# EAGLE design CNC-PowerSwitch-2016-v0.92 (EAGLE 7.7.0)

## Sheet 1 of 3
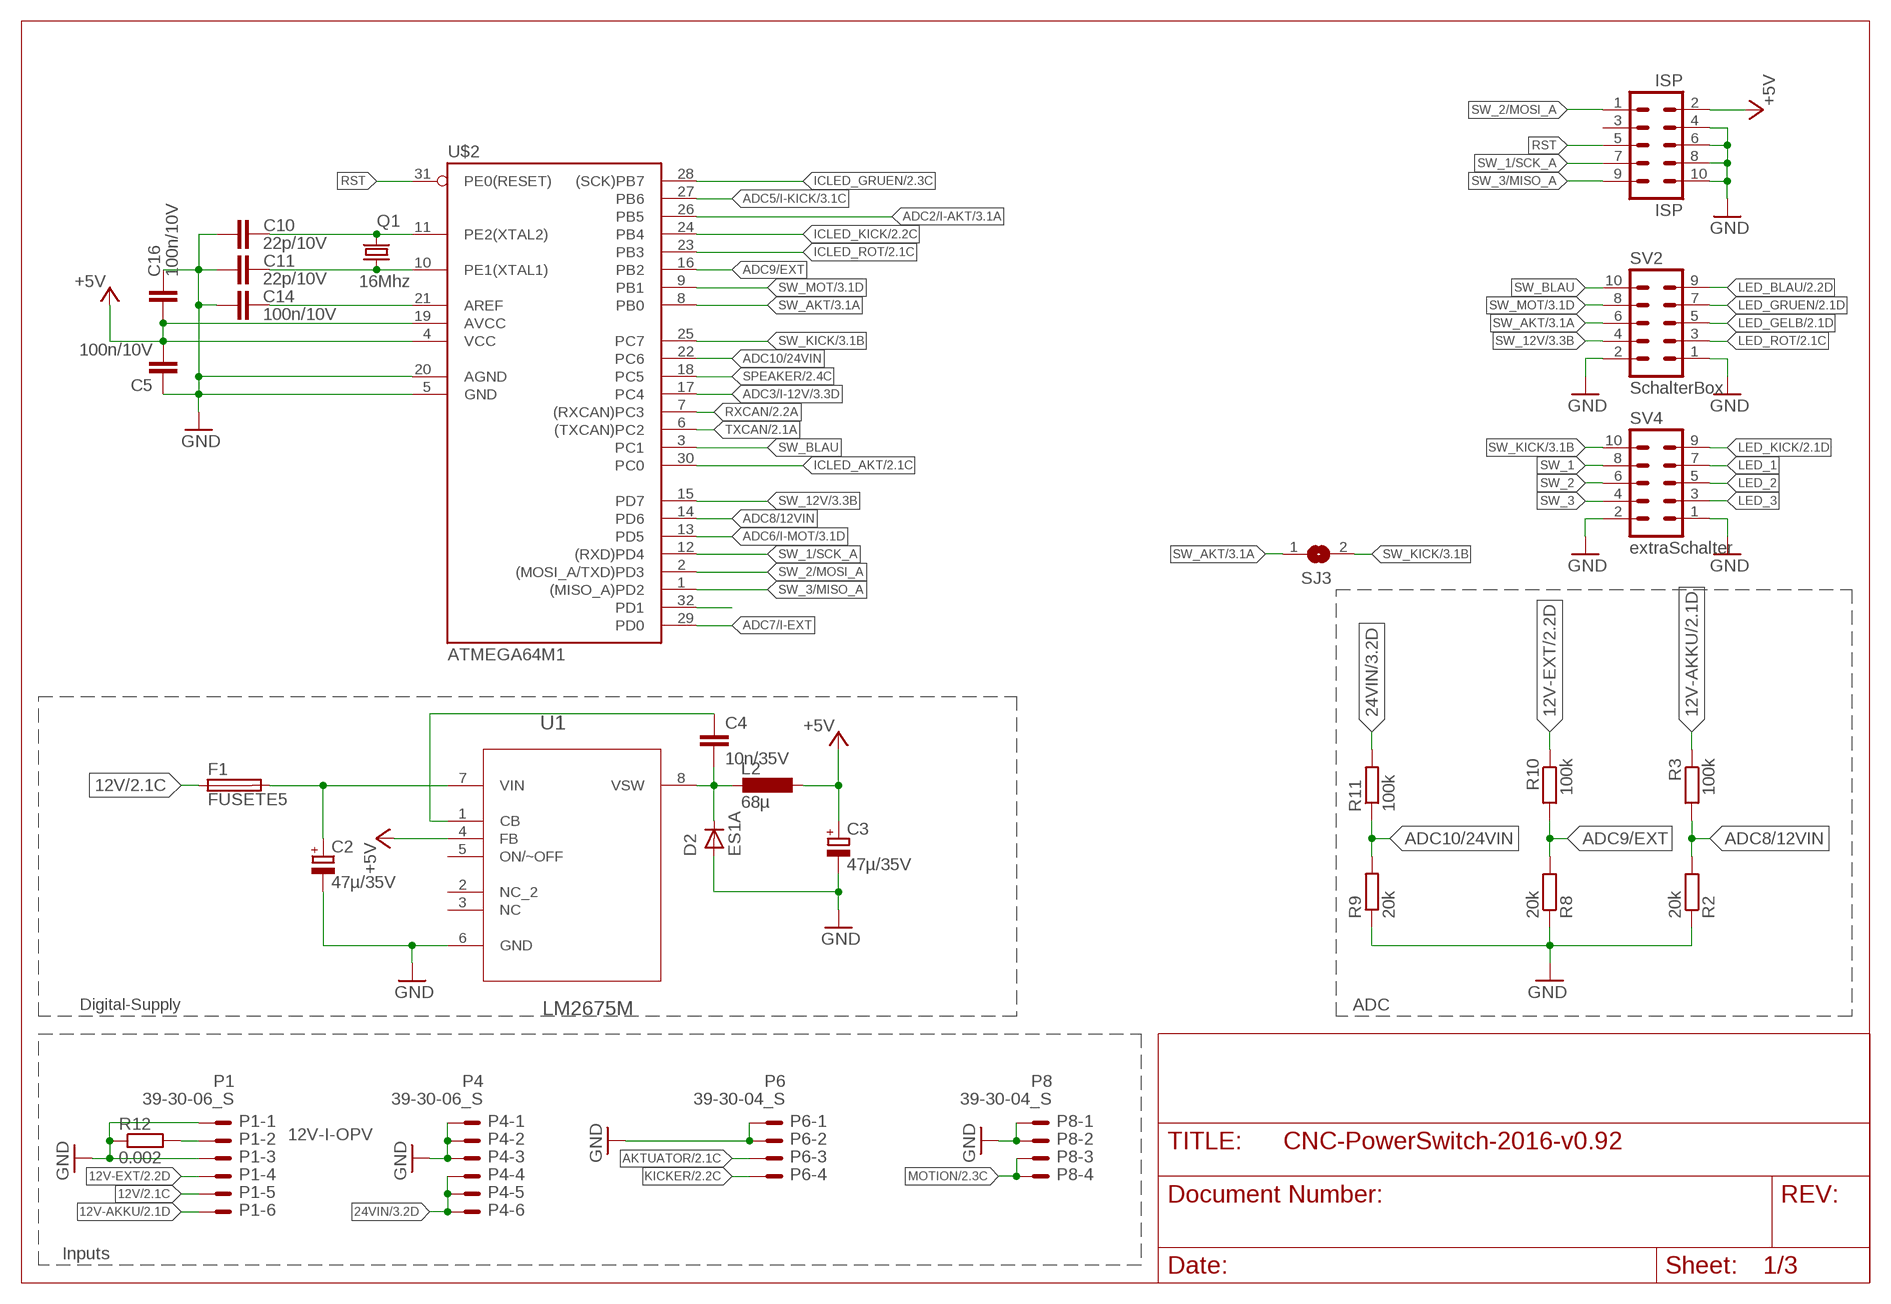
[diagram p0: schematic, sheet 1]

### Parts
C2  47µ/35V  CPOL-EUD  [PANASONIC_D]
C3  47µ/35V  CPOL-EUD  [PANASONIC_D]
C4  10n/35V  C-EUC0603  [C0603]
C5  100n/10V  C-EUC0603  [C0603]
C10  22p/10V  C-EUC0603  [C0603]
C11  22p/10V  C-EUC0603  [C0603]
C14  100n/10V  C-EUC0603  [C0603]
C16  100n/10V  C-EUC0603  [C0603]
D2  ES1A  GF1  [SMA-DO214AC]
F1  FUSETE5  [TE5]
ISP  ISP  ML10  [ML10]
L2  68µ  L-EUPISM  [PISM]
P1  39-30-06_S  [39-30-?06?]
P4  39-30-06_S  [39-30-?06?]
P6  39-30-04_S  [39-30-?04?]
P8  39-30-04_S  [39-30-?04?]
Q1  16Mhz  CRYSTALHC49UP  [HC49UP]
R2  20k  R-EU_R0805  [R0805]
R3  100k  R-EU_R0805  [R0805]
R8  20k  R-EU_R0805  [R0805]
R9  20k  R-EU_R0805  [R0805]
R10  100k  R-EU_R0805  [R0805]
R11  100k  R-EU_R0805  [R0805]
R12  0.002  R-EU_R2512  [R2512]
SJ3  SJ  [SJ]
SV2  SchalterBox  ML10  [ML10]
SV4  extraSchalter  ML10  [ML10]
U1  LM2675M  LM2675M-3.3  [SOIC127P620X175-8N]
U$2  ATMEGA64M1  [TQFP32-08]

### Nets
12V: F1.1 P1.5 ; also sheet 2,3
12V-AKKU: P1.6 R3.1 ; also sheet 2,3
12V-EXT: P1.4 R10.1 ; also sheet 2,3
12V-I-OPV: P1.2 R12.2 ; also sheet 3
24VIN: P4.4 P4.5 P4.6 R11.2 ; also sheet 3
+5V: C3.+ C5.2 C16.1 ISP.2 L2.1 U1.4(FB) U$2.4(VCC) U$2.19(AVCC) ; also sheet 2,3
ADC2/I-AKT: U$2.26(PB5) ; also sheet 3
ADC3/I-12V: U$2.17(PC4) ; also sheet 3
ADC5/I-KICK: U$2.27(PB6) ; also sheet 3
ADC6/I-MOT: U$2.13(PD5) ; also sheet 3
ADC7/I-EXT: U$2.29(PD0)
ADC8/12VIN: R2.2 R3.2 U$2.14(PD6)
ADC9/EXT: R8.2 R10.2 U$2.16(PB2)
ADC10/24VIN: R9.2 R11.1 U$2.22(PC6)
AKTUATOR: P6.3 ; also sheet 2,3
GND: C2.- C3.- C5.1 C10.1 C11.1 C14.1 C16.2 D2.A ISP.4 ISP.6 ISP.8 ISP.10 P1.1 P1.3 P4.1 P4.2 P4.3 P6.1 P6.2 P8.1 P8.2 R2.1 R8.1 R9.1 R12.1 SV2.1 SV2.2 SV4.1 SV4.2 U1.6(GND) U$2.5(GND) U$2.20(AGND) ; also sheet 2,3
ICLED_AKT: U$2.30(PC0) ; also sheet 2
ICLED_GRUEN: U$2.28((SCK)PB7) ; also sheet 2
ICLED_KICK: U$2.24(PB4) ; also sheet 2
ICLED_ROT: U$2.23(PB3) ; also sheet 2
KICKER: P6.4 ; also sheet 2,3
LED_1: SV4.7
LED_2: SV4.5
LED_3: SV4.3
LED_BLAU: SV2.9 ; also sheet 2
LED_GELB: SV2.5 ; also sheet 2
LED_GRUEN: SV2.7 ; also sheet 2
LED_KICK: SV4.9 ; also sheet 2
LED_ROT: SV2.3 ; also sheet 2
MOTION: P8.3 P8.4 ; also sheet 2,3
N$3: U$2.32(PD1)
N$10: C10.2 Q1.2 U$2.11(PE2(XTAL2))
N$11: C11.2 Q1.1 U$2.10(PE1(XTAL1))
N$13: C14.2 U$2.21(AREF)
N$22: C2.+ F1.2 U1.7(VIN)
N$27: C4.2 D2.K(C) L2.2 U1.8(VSW)
N$29: C4.1 U1.1(CB)
RST: ISP.5 U$2.31(PE0(RESET))
RXCAN: U$2.7((RXCAN)PC3) ; also sheet 2
SPEAKER: U$2.18(PC5) ; also sheet 2
SW_1: SV4.8
SW_1/SCK_A: ISP.7 U$2.12((RXD)PD4)
SW_2: SV4.6
SW_2/MOSI_A: ISP.1 U$2.2((MOSI_A/TXD)PD3)
SW_3: SV4.4
SW_3/MISO_A: ISP.9 U$2.1((MISO_A)PD2)
SW_12V: SV2.4 U$2.15(PD7) ; also sheet 3
SW_AKT: SJ3.1 SV2.6 U$2.8(PB0) ; also sheet 3
SW_BLAU: SV2.10 U$2.3(PC1)
SW_KICK: SJ3.2 SV4.10 U$2.25(PC7) ; also sheet 3
SW_MOT: SV2.8 U$2.9(PB1) ; also sheet 3
TXCAN: U$2.6((TXCAN)PC2) ; also sheet 2
Unconnected: ISP.3 U1.2(NC_2) U1.3(NC) U1.5(ON/~OFF)

### Notes on the sheet
- Digital-Supply | ADC
- Inputs

## Sheet 2 of 3
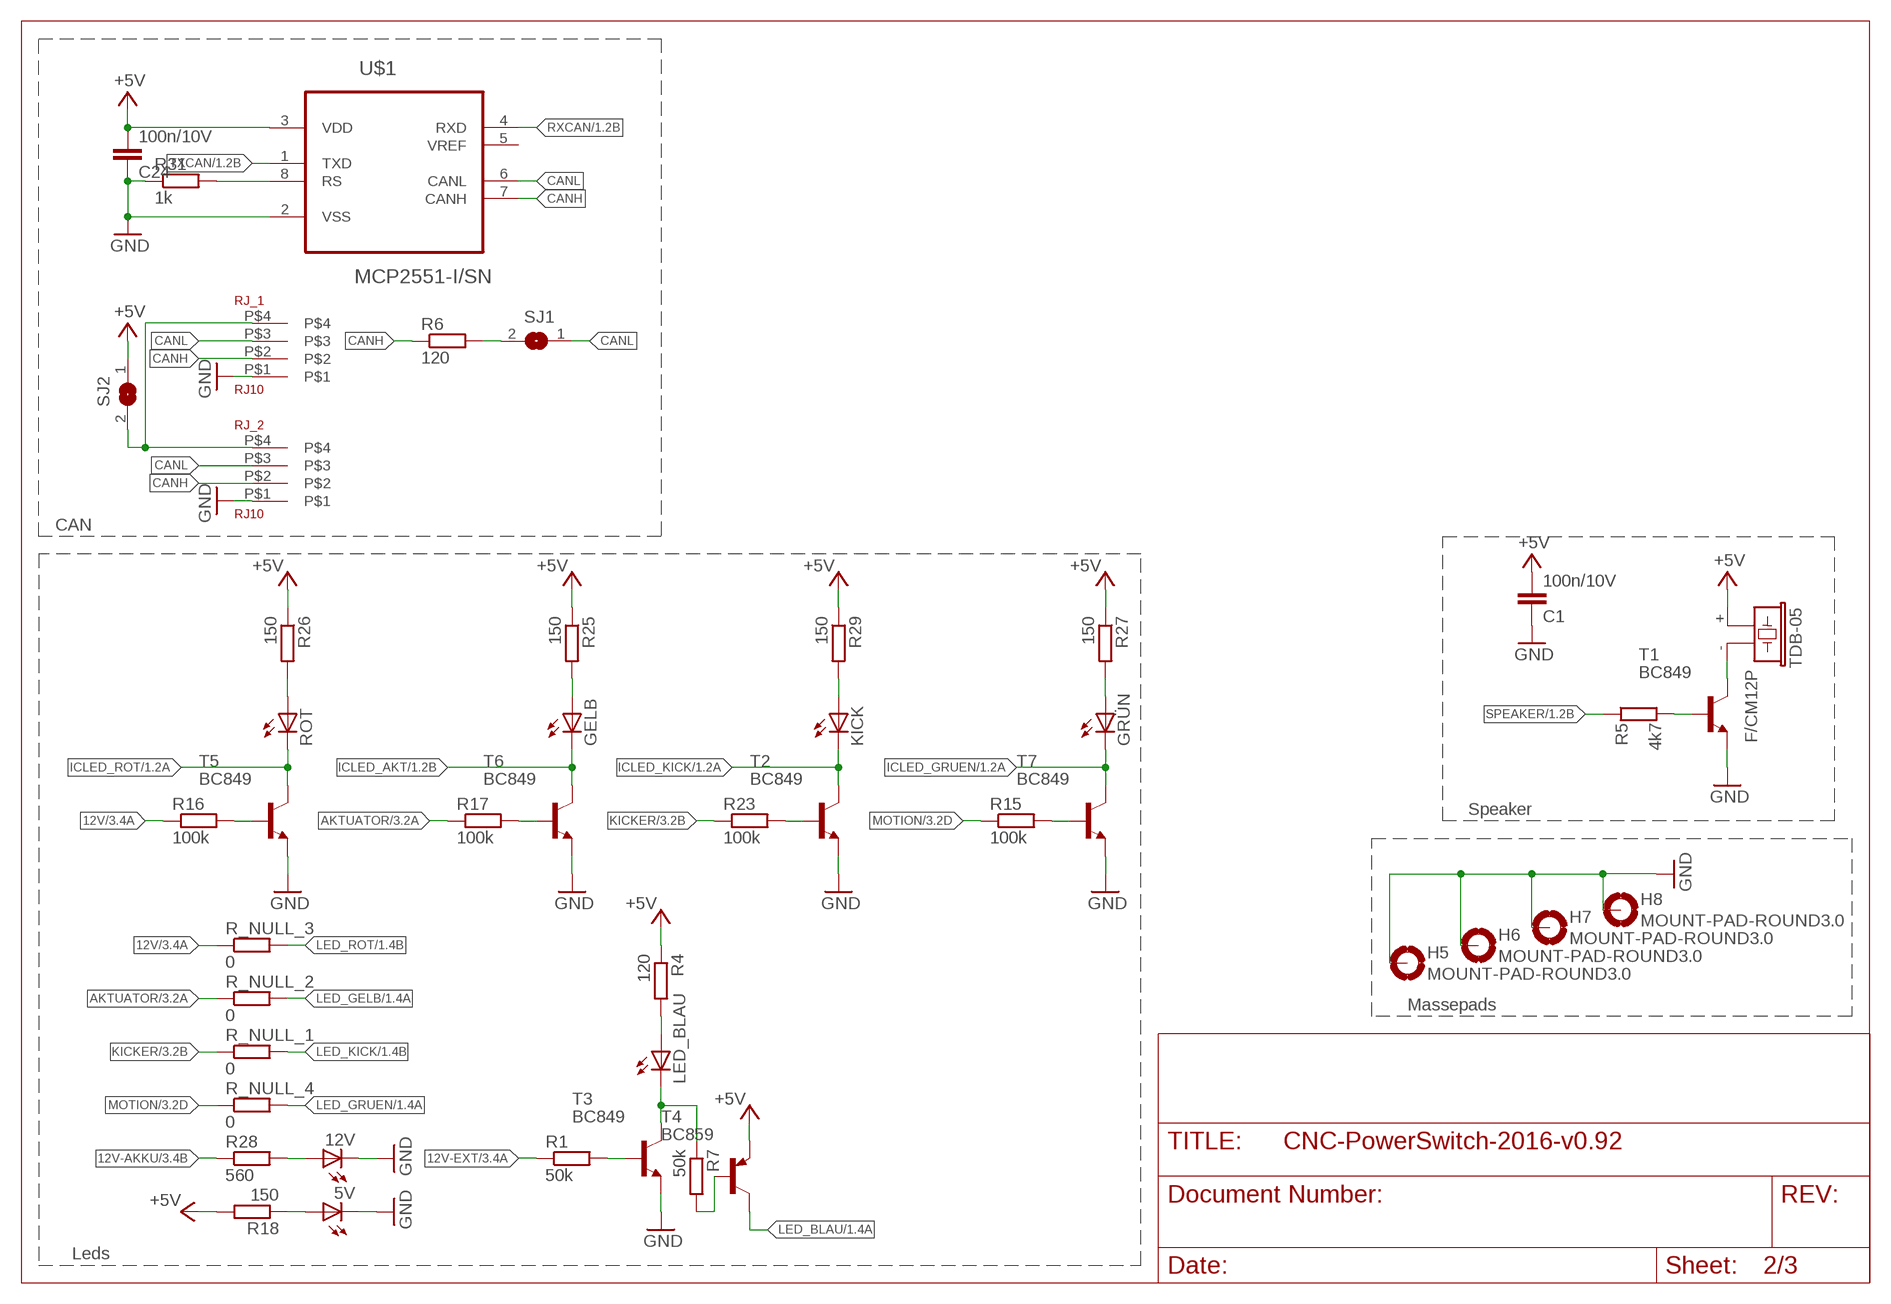
[diagram p1: schematic, sheet 2]

### Parts
5V  LEDCHIPLED_0805  [CHIPLED_0805]
12V  LEDCHIPLED_0805  [CHIPLED_0805]
C1  100n/10V  C-EUC0603  [C0603]
C24  100n/10V  C-EUC0603  [C0603]
GELB  LEDCHIPLED_0805  [CHIPLED_0805]
GRÜN  LEDCHIPLED_0805  [CHIPLED_0805]
H5  MOUNT-PAD-ROUND3.0  [3,0-PAD]
H6  MOUNT-PAD-ROUND3.0  [3,0-PAD]
H7  MOUNT-PAD-ROUND3.0  [3,0-PAD]
H8  MOUNT-PAD-ROUND3.0  [3,0-PAD]
KICK  LEDCHIPLED_0805  [CHIPLED_0805]
LED_BLAU  LEDCHIPLED_0805  [CHIPLED_0805]
R1  50k  R-EU_R0805  [R0805]
R4  120  R-EU_R0805  [R0805]
R5  4k7  R-EU_R0805  [R0805]
R6  120  R-EU_M0805  [M0805]
R7  50k  R-EU_R0805  [R0805]
R15  100k  R-EU_R0805  [R0805]
R16  100k  R-EU_R0805  [R0805]
R17  100k  R-EU_R0805  [R0805]
R18  150  R-EU_R0805  [R0805]
R23  100k  R-EU_R0805  [R0805]
R25  150  R-EU_R0805  [R0805]
R26  150  R-EU_R0805  [R0805]
R27  150  R-EU_R0805  [R0805]
R28  560  R-EU_R0805  [R0805]
R29  150  R-EU_R0805  [R0805]
R31  1k  R-EU_R0805  [R0805]
R_NULL_1  0  R-EU_R0402  [R0402]
R_NULL_2  0  R-EU_R0402  [R0402]
R_NULL_3  0  R-EU_R0402  [R0402]
R_NULL_4  0  R-EU_R0402  [R0402]
RJ_1  RJ10  [RJ10]
RJ_2  RJ10  [RJ10]
ROT  LEDCHIPLED_0805  [CHIPLED_0805]
SJ1  SJ  [SJ]
SJ2  SJ  [SJ]
T1  BC849  [SOT23]
T2  BC849  [SOT23]
T3  BC849  [SOT23]
T4  BC859  BC858C-PNP-SOT23-BEC  [SOT23-BEC]
T5  BC849  [SOT23]
T6  BC849  [SOT23]
T7  BC849  [SOT23]
TDB-05  F/CM12P  [F/CM12P]
U$1  MCP2551-I/SN  [SOIC127P600X175-8N]

### Nets
12V: R16.1 R_NULL_3.1 ; also sheet 1,3
12V-AKKU: R28.1 ; also sheet 1,3
12V-EXT: R1.1 ; also sheet 1,3
+5V: C1.2 C24.2 R4.1 R18.2 R25.1 R26.1 R27.1 R29.1 SJ2.1 T4.E TDB-05.+ U$1.3(VDD) ; also sheet 1,3
AKTUATOR: R17.1 R_NULL_2.1 ; also sheet 1,3
CANH: R6.1 RJ_1.P$2 RJ_2.P$2 U$1.7(CANH)
CANL: RJ_1.P$3 RJ_2.P$3 SJ1.1 U$1.6(CANL)
GND: 5V.C 12V.C C1.1 C24.1 H5.B3,0(MOUNT) H6.B3,0(MOUNT) H7.B3,0(MOUNT) H8.B3,0(MOUNT) R31.1 RJ_1.P$1 RJ_2.P$1 T1.2(E) T2.2(E) T3.2(E) T5.2(E) T6.2(E) T7.2(E) U$1.2(VSS) ; also sheet 1,3
ICLED_AKT: GELB.C T6.3(C) ; also sheet 1
ICLED_GRUEN: GRÜN.C T7.3(C) ; also sheet 1
ICLED_KICK: KICK.C T2.3(C) ; also sheet 1
ICLED_ROT: ROT.C T5.3(C) ; also sheet 1
KICKER: R23.1 R_NULL_1.1 ; also sheet 1,3
LED_BLAU: T4.C ; also sheet 1
LED_GELB: R_NULL_2.2 ; also sheet 1
LED_GRUEN: R_NULL_4.2 ; also sheet 1
LED_KICK: R_NULL_1.2 ; also sheet 1
LED_ROT: R_NULL_3.2 ; also sheet 1
MOTION: R15.1 R_NULL_4.1 ; also sheet 1,3
N$1: R5.2 T1.1(B)
N$2: RJ_1.P$4 RJ_2.P$4 SJ2.2
N$4: R23.2 T2.1(B)
N$5: KICK.A R29.2
N$6: R31.2 U$1.8(RS)
N$7: R6.2 SJ1.2
N$8: GELB.A R25.2
N$9: R26.2 ROT.A
N$14: R1.2 T3.1(B)
N$15: LED_BLAU.A R4.2
N$16: LED_BLAU.C R7.1 T3.3(C)
N$17: R7.2 T4.B
N$20: T1.3(C) TDB-05.-
N$21: GRÜN.A R27.2
N$24: 12V.A R28.2
N$102: R16.2 T5.1(B)
N$104: R17.2 T6.1(B)
N$106: R15.2 T7.1(B)
N$108: 5V.A R18.1
RXCAN: U$1.4(RXD) ; also sheet 1
SPEAKER: R5.1 ; also sheet 1
TXCAN: U$1.1(TXD) ; also sheet 1
Unconnected: U$1.5(VREF)

### Notes on the sheet
- CAN
- Speaker
- Massepads
- Leds

## Sheet 3 of 3
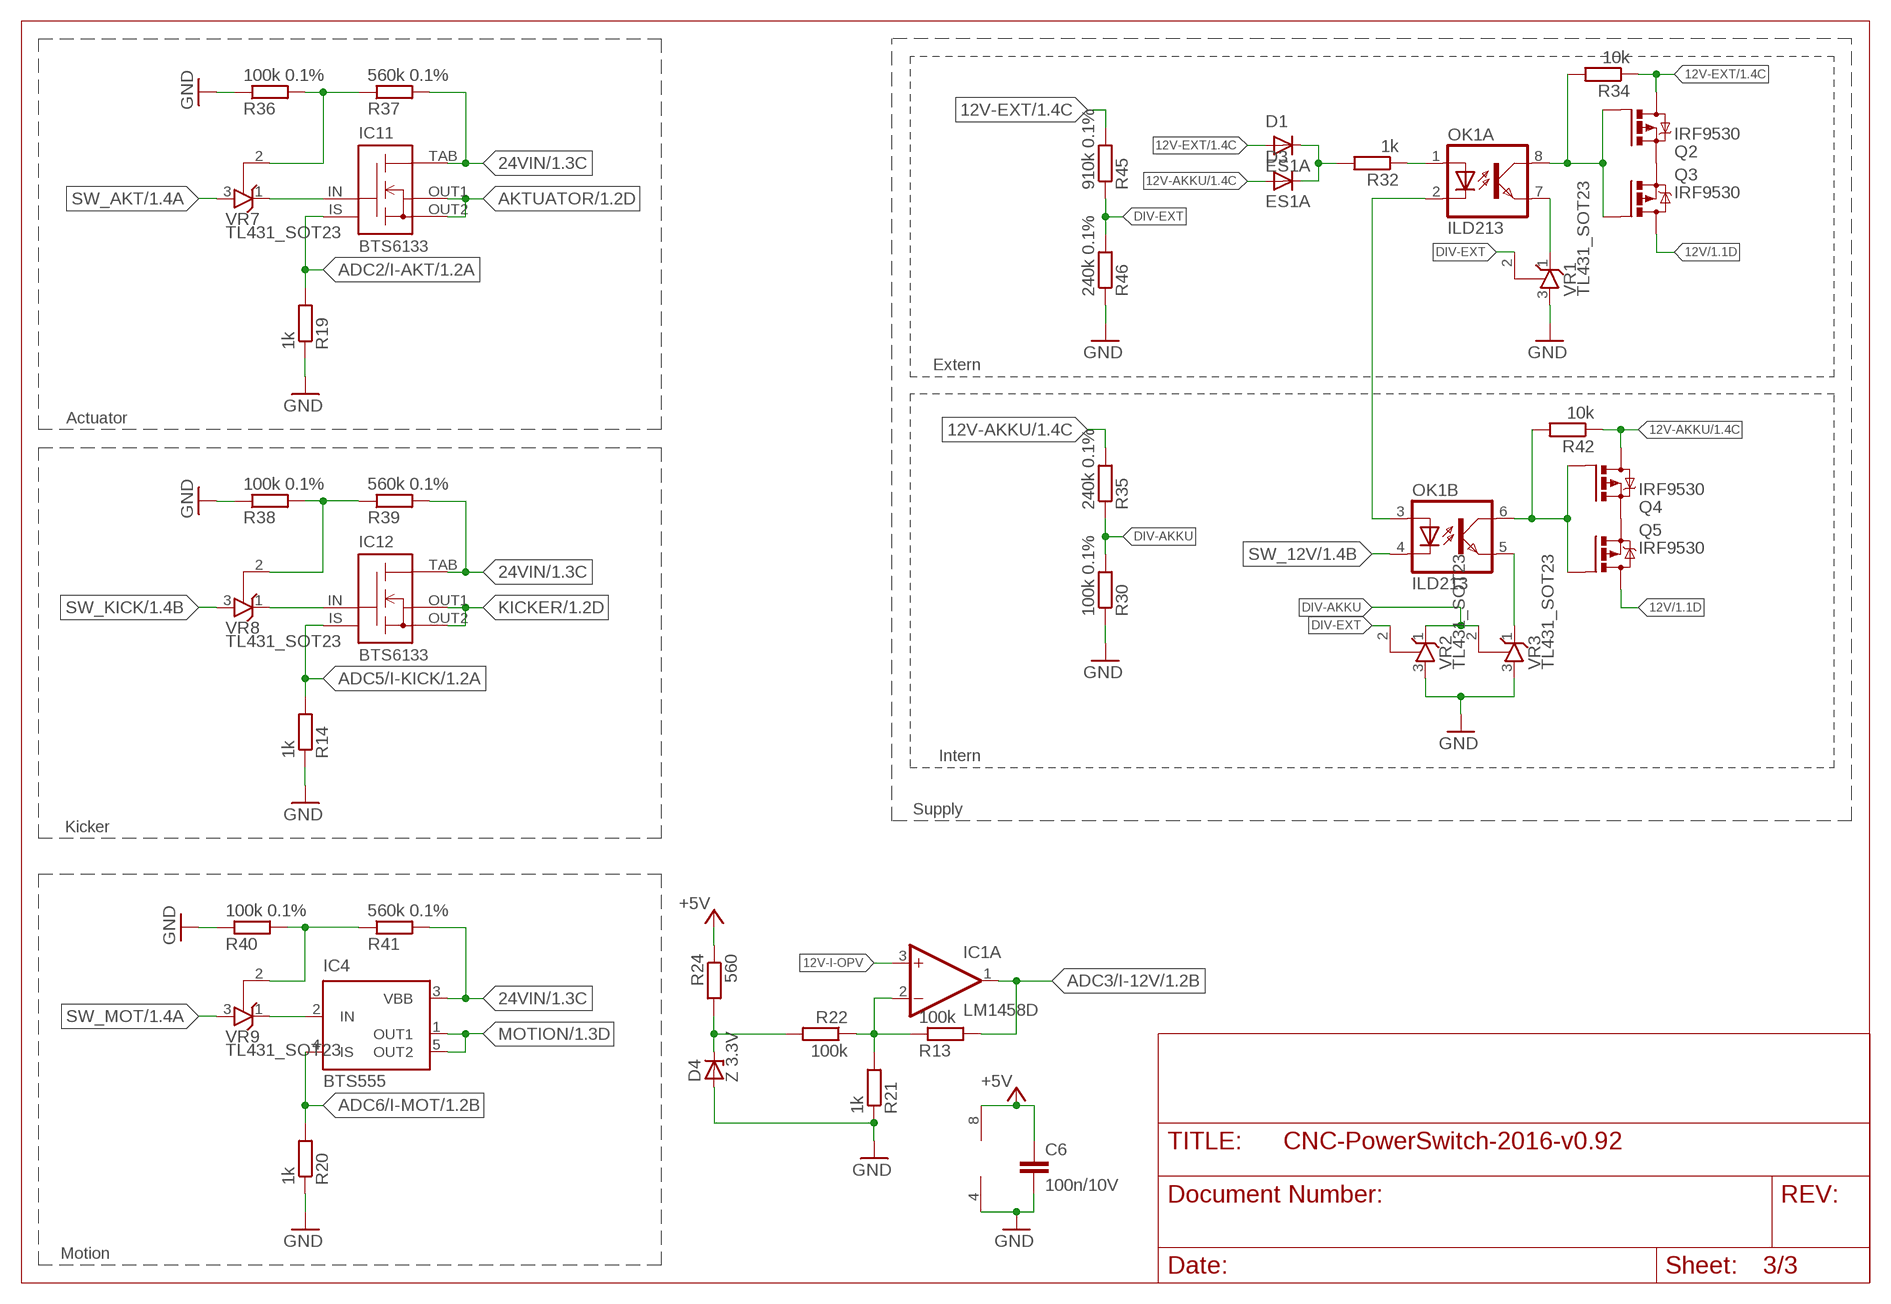
[diagram p2: schematic, sheet 3]

### Parts
C6  100n/10V  C-EUC0603  [C0603]
D1  ES1A  GF1  [SMA-DO214AC]
D3  ES1A  GF1  [SMA-DO214AC]
D4  Z 3.3V  ZENER-DIODESOT23  [SOT23]
IC1  LM1458D  [SO08]
IC4  BTS555  [TO220-51]
IC11  BTS6133  [TO252-51]
IC12  BTS6133  [TO252-51]
OK1  ILD213  [SOIC08]
Q2  IRF9530  [TO220BV]
Q3  IRF9530  [TO220BV]
Q4  IRF9530  [TO220BV]
Q5  IRF9530  [TO220BV]
R13  100k  R-EU_R0805  [R0805]
R14  1k  R-EU_R0805  [R0805]
R19  1k  R-EU_R0805  [R0805]
R20  1k  R-EU_R0805  [R0805]
R21  1k  R-EU_R0805  [R0805]
R22  100k  R-EU_R0805  [R0805]
R24  560  R-EU_R0805  [R0805]
R30  100k 0.1%  R-EU_R0805  [R0805]
R32  1k  R-EU_R0805  [R0805]
R34  10k  R-EU_R0805  [R0805]
R35  240k 0.1%  R-EU_R0805  [R0805]
R36  100k 0.1%  R-EU_R0805  [R0805]
R37  560k 0.1%  R-EU_R0805  [R0805]
R38  100k 0.1%  R-EU_R0805  [R0805]
R39  560k 0.1%  R-EU_R0805  [R0805]
R40  100k 0.1%  R-EU_R0805  [R0805]
R41  560k 0.1%  R-EU_R0805  [R0805]
R42  10k  R-EU_R0805  [R0805]
R45  910k 0.1%  R-EU_R0805  [R0805]
R46  240k 0.1%  R-EU_R0805  [R0805]
VR1  TL431_SOT23  [SOT23]
VR2  TL431_SOT23  [SOT23]
VR3  TL431_SOT23  [SOT23]
VR7  TL431_SOT23  [SOT23]
VR8  TL431_SOT23  [SOT23]
VR9  TL431_SOT23  [SOT23]

### Nets
12V: Q3.D Q5.D ; also sheet 1,2
12V-AKKU: D3.A Q4.D R35.2 R42.1 ; also sheet 1,2
12V-EXT: D1.A Q2.D R34.1 R45.2 ; also sheet 1,2
12V-I-OPV: IC1.3(A:+IN) ; also sheet 1
24VIN: IC4.3(VBB) IC11.TAB(VBB) IC12.TAB(VBB) R37.2 R39.2 R41.2 ; also sheet 1
+5V: C6.1 IC1.8(P:V+) R24.1 ; also sheet 1,2
ADC2/I-AKT: IC11.IS R19.2 ; also sheet 1
ADC3/I-12V: IC1.1(A:OUT) R13.2 ; also sheet 1
ADC5/I-KICK: IC12.IS R14.2 ; also sheet 1
ADC6/I-MOT: IC4.4(IS) R20.2 ; also sheet 1
AKTUATOR: IC11.OUT1(OUT) IC11.OUT2(OUT) ; also sheet 1,2
DIV-AKKU: R30.2 R35.1 VR2.1(C) VR3.2(R)
DIV-EXT: R45.1 R46.2 VR1.2(R) VR2.2(R)
GND: C6.2 D4.1(A) IC1.4(P:V-) R14.1 R19.1 R20.1 R21.1 R30.1 R36.1 R38.1 R40.1 R46.1 VR1.3(A) VR2.3(A) VR3.3(A) ; also sheet 1,2
KICKER: IC12.OUT1(OUT) IC12.OUT2(OUT) ; also sheet 1,2
MOTION: IC4.1(OUT1) IC4.5(OUT2) ; also sheet 1,2
N$12: OK1.1(A:A) R32.1
N$18: OK1.7(A:EMIT) VR1.1(C)
N$19: OK1.2(A:C) OK1.3(B:A)
N$25: IC1.2(A:-IN) R13.1 R21.2 R22.1
N$26: D4.3(C) R22.2 R24.2
N$28: Q2.S Q3.S
N$30: OK1.6(B:COL) Q4.G Q5.G R42.2
N$31: Q4.S Q5.S
N$32: OK1.5(B:EMIT) VR3.1(C)
N$35: D1.K(C) D3.K(C) R32.2
N$36: IC12.IN VR8.1(C)
N$37: IC4.2(IN) VR9.1(C)
N$40: IC11.IN VR7.1(C)
N$42: R36.2 R37.1 VR7.2(R)
N$44: R38.2 R39.1 VR8.2(R)
N$45: R40.2 R41.1 VR9.2(R)
N$49: OK1.8(A:COL) Q2.G Q3.G R34.2
SW_12V: OK1.4(B:C) ; also sheet 1
SW_AKT: VR7.3(A) ; also sheet 1
SW_KICK: VR8.3(A) ; also sheet 1
SW_MOT: VR9.3(A) ; also sheet 1
Unconnected: IC1.5(B:+IN) IC1.6(B:-IN) IC1.7(B:OUT)

### Notes on the sheet
- Extern
- Actuator
- Intern
- Supply
- Kicker
- Motion

## Library data of the parts
5V 12V GELB GRÜN KICK LED_BLAU ROT = led:LED: LED OSRAM: - CHIPLED LG R971, LG N971, LY N971, LG Q971, LY Q971, LO R971, LY R971 LH N974, LH R974 LS Q976, LO Q976, LY Q976 LO Q996 - Hyper CHIPLED LW Q18S LB Q993, LB Q99A, LB R99A - SideLED LS A670, LO A670, LY A670, LG A670, LP A670 LB A673, LV A673, LT A673, LW A673 LH A674 LY A675 LS A676, LA A676, LO A676, LY A676, LW A676 LS A679, LY A679, LG A679 - Hyper Micro SIDELED® LS Y876, LA Y876, LO Y876, LY Y876 LT Y87S - SmartLED LW L88C, LW L88S LB L89C, LB L89S, LG L890 LS L89K, LO L89K, LY L89K LS L896, LA L896, LO L896, LY L896 - TOPLED LS T670, LO T670, LY T670, LG T670, LP T670 LSG T670, LSP T670, LSY T670, LOP T670, LYG T670 LG T671, LOG T671, LSG T671 LB T673, LV T673, LT T673, LW T673 LH T674 LS T676, LA T676, LO T676, LY T676, LB T676, LH T676, LSB T676, LW T676 LB T67C, LV T67C, LT T67C, LS T67K, LO T67K, LY T67K, LW E67C LS E67B, LA E67B, LO E67B, LY E67B, LB E67C, LV E67C, LT E67C LW T67C LS T679, LY T679, LG T679 LS T770, LO T770, LY T770, LG T770, LP T770 LB T773, LV T773, LT T773, LW T773 LH T774 LS E675, LA E675, LY E675, LS T675 LS T776, LA T776, LO T776, LY T776, LB T776 LHGB T686 LT T68C, LB T68C - Hyper Mini TOPLED® LB M676 - Mini TOPLED Santana® LG M470 LS M47K, LO M47K, LY M47K Source: http://www.osram.convergy.de LUXEON: - LUMILED® LXK2-PW12-R00, LXK2-PW12-S00, LXK2-PW14-U00, LXK2-PW14-V00 LXK2-PM12-R00, LXK2-PM12-S00, LXK2-PM14-U00 LXK2-PE12-Q00, LXK2-PE12-R00, LXK2-PE12-S00, LXK2-PE14-T00, LXK2-PE14-U00 LXK2-PB12-K00, LXK2-PB12-L00, LXK2-PB12-M00, LXK2-PB14-N00, LXK2-PB14-P00, LXK2-PB14-Q00 LXK2-PR12-L00, LXK2-PR12-M00, LXK2-PR14-Q00, LXK2-PR14-R00 LXK2-PD12-Q00, LXK2-PD12-R00, LXK2-PD12-S00 LXK2-PH12-R00, LXK2-PH12-S00 LXK2-PL12-P00, LXK2-PL12-Q00, LXK2-PL12-R00 Source: www.luxeon.com KINGBRIGHT: KA-3528ASYC Source: www.kingbright.com
C1 C4-C6 C10 C11 C14 C16 C24 = rcl:C-EU: CAPACITOR, European symbol
C2 C3 = rcl:CPOL-EU: POLARIZED CAPACITOR, European symbol
D1-D3 = diode:GF1: DIODE
D4 = diode:ZENER-DIODE: Z-Diode
F1 = fuse:FUSE: Fuse; OC_FARNELL: unknown; OC_NEWARK: unknown
H5-H8 = holes:MOUNT-PAD-ROUND: MOUNTING PAD, round
IC1 = linear:*1458: OP AMP
IC4 = micro-siemens:BTS555: Smart Highside High Current Power Switch PROFET® Source: http://www.infineon.com/upload/Document/cmc_upload/documents/011/8726/Datasheet_BTS555.pdf; MF: FARNELL; MPN: BTS555.; OC_FARNELL: 4109260; OC_NEWARK: 26H6766
IC11 IC12 = BTS443P:BTS6133
ISP SV2 SV4 = con-ml:ML10: HARTING; OC_FARNELL: unknown; OC_NEWARK: unknown
L2 = Inductor-Fastron:L-EU
OK1 = optocoupler:ILD2*: Siemens ILD205/206/207/211/213/217 DUAL PHOTOTRANSISTOR SMALL OUTLINE SURFACE MOUNT OPTOCOUPLER Source: 153385-da-01-en-Optocoupler_ILD205-T.pdf; MF: VISHAY/TELEFUNKEN; MPN: ILD213T; OC_FARNELL: 1045451; OC_NEWARK: 20H8680
P1 P4 = con-molex-mini-fit:39-30-?06?_S: HEADER
P6 P8 = con-molex-mini-fit:39-30-?04?_S: HEADER
Q1 = crystal:CRYSTAL: CRYSTAL; OC_FARNELL: unknown; OC_NEWARK: unknown
Q2-Q5 = transistor-power:IRF9530: P-CHANNEL HEXFET POWER-MOS-FET Source: http://www.irf.com/product-info/datasheets/data/irf9530.pdf
R1-R32 R34-R42 R45 R46 R_NULL_1-R_NULL_4 = rcl:R-EU_: RESISTOR, European symbol
RJ_1 RJ_2 = ownParts:RJ10
SJ1-SJ3 = jumper:SJ: SMD solder JUMPER
T1-T3 T5-T7 = transistor:BC849: NPN TRANSISTOR
T4 = transistor:*-PNP-: PNP Transistror
TDB-05 = buzzer:F/CM12P: BUZZER Source: Buerklin; OC_FARNELL: unknown; OC_NEWARK: unknown
U1 = LM2675:LM2675M-3.3: Step-Down Voltage Regulator; MPN: LM2675M-3.3; OC_FARNELL: 9489800; OC_NEWARK: 41K4140; PACKAGE: 8-SOIC; SUPPLIER: National Semiconductors
U$1 = Microchip-MCP2551-I_SN:MCP2551-I/SN: High-Speed CAN Transceiver; MPN: MCP2551-I/SN; OC_FARNELL: 9758569; OC_NEWARK: 69K7604; PACKAGE: SOIC-8; SUPPLIER: Microchip
U$2 = atmega16m1-32m1-64m1:ATMEGA64M1
VR1-VR3 VR7-VR9 = 1_USER:TL431

## Board
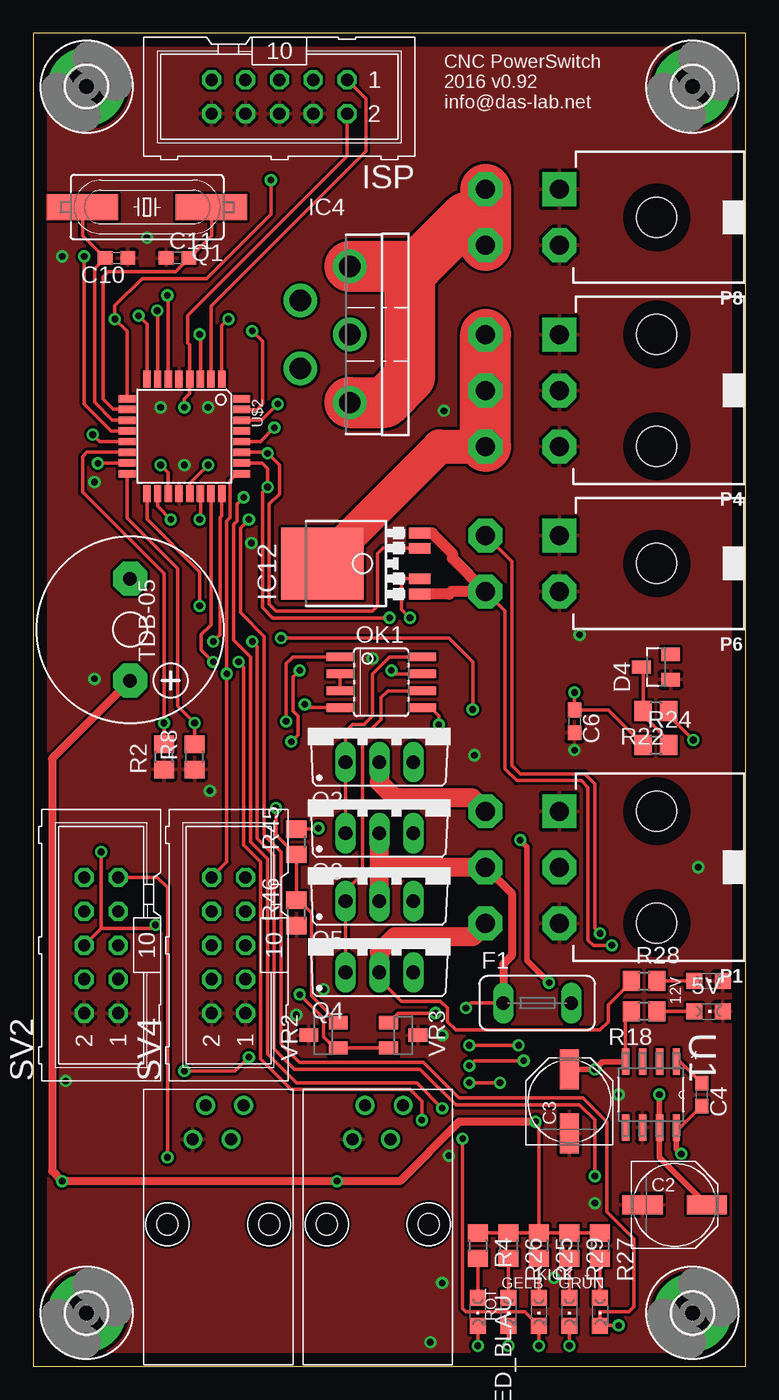
[diagram p3: board, top side]
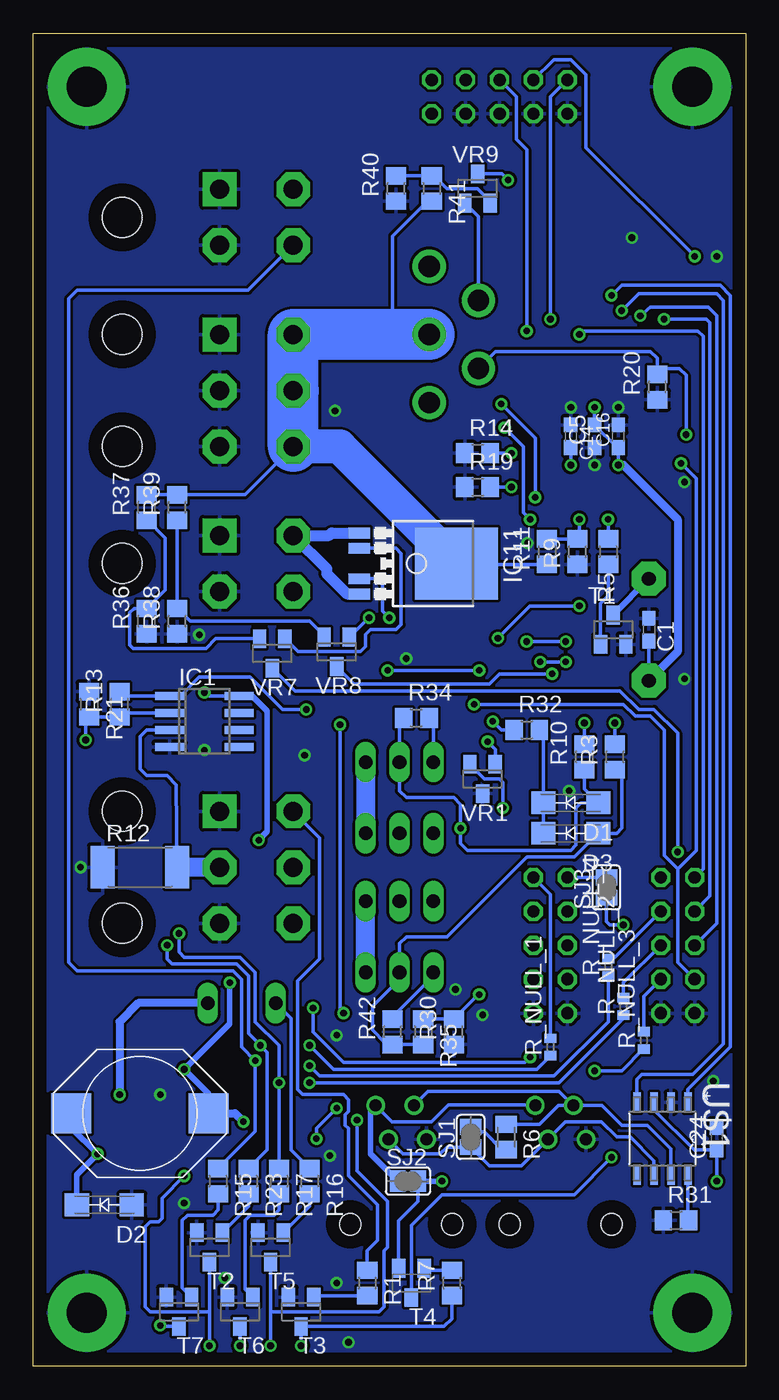
[diagram p4: board, bottom side, seen from below]

Size 53.32 x 99.75 mm. Coordinates in mm from the lower left corner, seen from the top.
Outline: 0,0 53.32,0 53.32,99.75 0,99.75 0,0
Copper layers (1*16): Top 0.035mm / dielectric 1.5mm / Bottom 0.035mm
Design rules "8mils": minimum track width 8mil, minimum drill 0.6mm, track to track 8mil, track to pad 8mil, pad to pad 8mil, via to via 8mil, smd to smd 8mil, copper to edge 40mil, drill to drill 10mil, minimum pad ring 10mil, minimum via ring 8mil, stop-mask expansion 0mil, vias tented up to drill 0mil, thermal gap 10mil

### Footprints (pad centres in the part's own frame; a part is rotated, then mirrored left to right if it is on the bottom)
CHIPLED_0805 = smd 1.2 x 1.2: A 0,-1.05; C 0,1.05
C0603 = smd 1.1 x 1: 1 -0.85,0; 2 0.85,0
PANASONIC_D = smd 3 x 1.4: + 2.4,0; - -2.4,0
SMA-DO214AC = smd 1.8 x 1.7: A -2.05,0; K 2.05,0
SOT23 = smd 1 x 1.4: 1 -0.95,-1.1; 2 0.95,-1.1; 3 0,1.1
TE5 = drill 1.016 long: 1 -2.54,0; 2 2.54,0
3,0-PAD = drill 3 pad 5.842: B3,0 0,0
SO08 = smd 0.6 x 2.2: 1 -1.905,-2.6; 2 -0.635,-2.6; 3 0.635,-2.6; 4 1.905,-2.6; 5 1.905,2.6; 6 0.635,2.6; 7 -0.635,2.6; 8 -1.905,2.6
TO220-51 = drill 1.6 pad 2.5: 1 -5.1,-4.5; 2 -2.55,-8.2; 3 0,-4.5; 4 2.55,-8.2; 5 5.1,-4.5
TO252-51 = smd 0.8 x 1.6: IN -1.14,-4.8; IS 1.14,-4.8; OUT1 -2.28,-4.8; OUT2 2.28,-4.8 | smd 5.4 x 6.2: TAB 0,2.5
ML10 = drill 0.914 octagon: 1 -5.08,-1.27; 2 -5.08,1.27; 3 -2.54,-1.27; 4 -2.54,1.27; 5 0,-1.27; 6 0,1.27; 7 2.54,-1.27; 8 2.54,1.27; 9 5.08,-1.27; 10 5.08,1.27
PISM = smd 3 x 3: 1 -5.15,0; 2 5.15,0
SOIC08 = smd 0.66 x 2.032: 1 -1.905,-3.073; 2 -0.635,-3.073; 3 0.635,-3.073; 4 1.905,-3.073; 5 1.905,3.073; 6 0.635,3.073; 7 -0.635,3.073; 8 -1.905,3.073
39-30-?06? = drill 1.422 pad 2.54 square: 1 4.191,0 | drill 1.422 pad 2.54 octagon: 2 0,0; 3 -4.191,0; 4 4.191,5.512; 5 0,5.512; 6 -4.191,5.512 | hole 3: -4.191,-7.3; 4.191,-7.3
39-30-?04? = drill 1.422 pad 2.54 square: 1 2.095,0 | drill 1.422 pad 2.54 octagon: 2 -2.095,0; 3 2.095,5.512; 4 -2.095,5.512 | hole 3: 0,-7.3
HC49UP = smd 5.334 x 1.93: 1 -4.826,0; 2 4.826,0
TO220BV = drill 1.016 long: D 0,-2.54; G -2.54,-2.54; S 2.54,-2.54
R0805 = smd 1.3 x 1.5: 1 -0.95,0; 2 0.95,0
M0805 = smd 1.3 x 1.6: 1 -0.95,0; 2 0.95,0
R2512 = smd 1.8 x 3.2: 1 -2.8,0; 2 2.8,0
R0402 = smd 0.7 x 0.9: 1 -0.65,0; 2 0.65,0
RJ10 = drill 0.9: P$1 -1.905,6.55; P$2 -0.953,9.09; P$3 0.953,6.55; P$4 1.905,9.09 | hole 1.59: -3.81,0.2; 3.81,0.2
SJ = smd 1.168 x 1.6: 1 -0.762,0; 2 0.762,0
SOT23-BEC = smd 1 x 1.4: B -0.95,-1.1; C 0,1.1; E 0.95,-1.1
F/CM12P = drill 1.016 pad 2.54 octagon: + 3.81,0; - -3.81,0
SOIC127P620X175-8N = smd 1.981 x 0.559: 1 -2.464,1.905; 2 -2.464,0.635; 3 -2.464,-0.635; 4 -2.464,-1.905; 5 2.464,-1.905; 6 2.464,-0.635; 7 2.464,0.635; 8 2.464,1.905
SOIC127P600X175-8N = smd 1.473 x 0.559: 1 -2.718,1.905; 2 -2.718,0.635; 3 -2.718,-0.635; 4 -2.718,-1.905; 5 2.718,-1.905; 6 2.718,-0.635; 7 2.718,0.635; 8 2.718,1.905
TQFP32-08 = smd 1.27 x 0.559: 1 -4.293,2.8; 2 -4.293,2; 3 -4.293,1.2; 4 -4.293,0.4; 5 -4.293,-0.4; 6 -4.293,-1.2; 7 -4.293,-2; 8 -4.293,-2.8; 17 4.293,-2.8; 18 4.293,-2; 19 4.293,-1.2; 20 4.293,-0.4; 21 4.293,0.4; 22 4.293,1.2; 23 4.293,2; 24 4.293,2.8 | smd 0.559 x 1.27: 9 -2.8,-4.293; 10 -2,-4.293; 11 -1.2,-4.293; 12 -0.4,-4.293; 13 0.4,-4.293; 14 1.2,-4.293; 15 2,-4.293; 16 2.8,-4.293; 25 2.8,4.293; 26 2,4.293; 27 1.2,4.293; 28 0.4,4.293; 29 -0.4,4.293; 30 -1.2,4.293; 31 -2,4.293; 32 -2.8,4.293

### Placement (x,y rotation side)
5V  50.55,26.54 270 top
12V  50.55,28.83 270 top
C1  7.24,55.12 270 bottom
C2  48.01,12.06 0 top
C3  40.13,19.81 90 top
C4  50.04,20.32 270 top
C5  11.3,69.6 90 bottom
C6  40.51,48.26 270 top
C10  6.22,82.93 180 top
C11  10.79,82.93 0 top
C14  13.08,69.6 270 bottom
C16  9.53,69.6 90 bottom
C24  2.16,17.02 270 bottom
D1  13.08,42.16 180 bottom
D2  48.01,12.06 180 bottom
D3  13.08,39.88 180 bottom
D4  46.61,52.32 90 top
F1  37.72,27.18 0 top
GELB  37.85,4.06 180 top
GRÜN  42.42,4.06 180 top
H5  3.98,95.76 0 top
H6  49.33,95.76 0 top
H7  3.98,3.98 0 top
H8  49.33,3.98 0 top
IC1  40.51,48.26 270 bottom
IC4  28.19,77.22 270 top
IC11  24.13,60.07 270 bottom
IC12  24.13,60.07 90 top
ISP  18.41,95 180 top
KICK  40.13,4.06 180 top
L2  45.34,18.92 180 bottom
LED_BLAU  33.27,4.06 180 top
OK1  26.04,51.18 270 top
P1  39-30-06?_S  [39-30-?06?]  39.37,37.34 90 top
P4  39-30-06?_S  [39-30-?06?]  39.37,73.03 90 top
P6  39-30-04?_S  [39-30-?04?]  39.37,60.07 90 top
P8  39-30-04?_S  [39-30-?04?]  39.37,85.98 90 top
Q1  8.51,86.74 180 top
Q2  25.91,47.75 0 top
Q3  25.91,42.42 0 top
Q4  25.91,32 0 top
Q5  25.91,37.34 0 top
R1  28.32,6.22 270 bottom
R2  9.78,45.59 90 top
R3  9.78,45.59 90 bottom
R4  33.27,9.02 270 top
R5  10.29,60.96 270 bottom
R6  17.91,17.14 270 bottom
R7  21.97,6.22 90 bottom
R8  12.06,45.59 90 top
R9  12.57,60.96 90 bottom
R10  12.06,45.59 90 bottom
R11  14.86,60.96 270 bottom
R12  45.34,37.34 0 bottom
R13  46.86,49.53 90 bottom
R14  20.07,68.33 0 bottom
R15  39.5,13.84 270 bottom
R16  32.64,13.84 270 bottom
R17  34.92,13.84 270 bottom
R18  45.72,26.54 180 top
R19  20.07,65.79 0 bottom
R20  6.6,73.28 90 bottom
R21  49.15,49.53 270 bottom
R22  46.61,49.02 180 top
R23  37.21,13.84 270 bottom
R24  46.61,46.48 0 top
R25  37.85,9.02 270 top
R26  35.56,9.02 270 top
R27  42.42,9.02 270 top
R28  45.72,28.83 0 top
R29  40.13,9.02 270 top
R30  21.84,25.02 90 bottom
R31  5.21,10.92 0 bottom
R32  16.38,47.62 0 bottom
R34  24.64,48.51 0 bottom
R35  24.13,25.02 270 bottom
R36  44.83,55.75 90 bottom
R37  44.83,64.26 90 bottom
R38  42.55,55.75 90 bottom
R39  42.55,64.26 90 bottom
R40  26.16,88.14 90 bottom
R41  23.5,88.14 270 bottom
R42  26.42,25.02 90 bottom
R45  19.68,39.24 90 top
R46  19.68,33.91 90 top
R_NULL_1  14.61,23.88 90 bottom
R_NULL_2  9.14,26.92 90 bottom
R_NULL_3  7.62,24.38 90 bottom
R_NULL_4  10.29,29.84 90 bottom
RJ_1  13.84,10.41 0 top
RJ_2  25.78,10.41 0 top
ROT  35.56,4.06 180 top
SJ1  20.57,17.14 90 bottom
SJ2  25.27,13.84 180 bottom
SJ3  10.41,35.81 90 bottom
SV2  5.08,31.5 90 top
SV4  14.61,31.5 90 top
T1  9.91,55.12 0 bottom
T2  40.13,8.89 180 bottom
T3  33.27,4.06 180 bottom
T4  25.02,6.22 180 bottom
T5  35.56,8.89 180 bottom
T6  37.85,4.06 180 bottom
T7  42.42,4.06 180 bottom
TDB-05  7.24,55.12 270 top
U1  46.23,20.32 270 top
U$1  6.22,17.02 270 bottom
U$2  11.3,69.6 270 top
VR1  19.68,43.94 180 bottom
VR2  21.72,24.77 90 top
VR3  27.69,24.77 270 top
VR7  35.43,53.34 180 bottom
VR8  30.61,53.47 180 bottom
VR9  20.07,88.14 0 bottom

### Tracks (layer width: path | path; a pad name or v marks a point on that pad's centre or on a via)
12V  (via drill 0.5)
  Top 0.254: v11.3,22.1 15.11,22.1 v16.13,23.11 | v32.38,26.8 32.77,27.18 F1.1
  Top 0.61: P1.5 35.81,35.38 35.81,30.73 35.18,30.1 F1.1
  Top 1.422: Q5.D 25.91,37.34 | 25.91,37.34 Q3.D | P1.5 25.91,37.34
  Bottom 0.254: R_NULL_3.1 7.63,23.73 9.27,22.1 v11.3,22.1 | F1.1 34.04,26.04 34.04,16.19 R16.1 | v16.13,23.11 16.51,22.73 30.1,22.73 32.38,25.02 v32.38,26.8
12V-AKKU
  Top 0.254: R28.1 44.77,28.77 43.05,27.05 43.05,25.78 42.42,25.15 31.62,25.15 30.99,25.78 30.99,26.8 30.48,27.3 27.56,27.3 25.91,28.96 Q4.D
  Top 1.422: P1.6 33.86,33.1 32.89,32.13 27.05,32.13 25.91,30.99 Q4.D
  Bottom 0.254: R35.2 R42.1 26.99,24.2 27.94,25.15 27.94,26.92 25.91,28.96 Q4.D 25.91,31.62 25.4,32.13 22.35,32.13 16.38,38.1 12.83,38.1 11.05,39.88 D3.A 9.65,39.88 9.27,40.26 9.27,44.13 R3.1
12V-EXT  (via drill 0.5)
  Top 0.254: R45.2 21.27,40.19 v21.34,40.26
  Top 1.422: P1.4 32.84,42.55 27.05,42.55 25.91,43.69 Q2.D
  Bottom 0.254: R1.1 28.32,8.64 27.56,9.4 27.56,12.06 29.72,14.22 29.72,17.78 29.97,18.03 29.97,18.8 29.72,19.05 29.72,19.94 30.1,20.32 33.15,20.32 33.53,20.7 33.53,28.83 31.88,30.48 31.88,39.55 P1.4 | R10.1 12.06,43.2 D1.A 12.32,42.16 12.7,41.78 12.7,38.99 13.08,38.61 20.83,38.61 21.34,39.12 v21.34,40.26 21.34,42.04 21.84,42.55 25.4,42.55 25.91,43.05 Q2.D 25.91,48.19 R34.1
12V-I-OPV
  Bottom 0.254: R12.2 42.61,43.5 43.31,44.2 44.83,44.2 45.34,44.7 45.34,47.12 44.83,47.62 IC1.3
  Bottom 1.422: P1.2 R12.2
24VIN
  Top 2.54: IC12.TAB 30.39,68.83 P4.6
  Top 3.81: P4.6 P4.4
  Bottom 0.254: R11.2 21.57,60.01 IC12.TAB | R41.2 23.81,87.19 26.42,84.58 26.42,77.47 26.67,77.22 | R37.2 R39.2 37.48,65.21 P4.6
  Bottom 2.54: IC12.TAB 30.39,68.83 P4.6
  Bottom 3.81: P4.5 P4.4 26.67,77.22 IC4.3 | P4.6 33.86,72.95
+5V  (via drill 0.5)
  Top 0.254: U$2.19 10.1,66.86 v9.53,67.44 | v11.3,71.75 11.3,72.39 11.7,72.79 U$2.4 11.7,76.44 11.56,76.58 11.56,78.61 23.5,90.55 ISP.2 | R27.1 R29.1 R25.1 | R25.1 37.85,18.03 v37.59,18.29 | R25.1 R26.1 R4.1 | U1.4 44.32,26.1 R18.2 | v40.51,50.42 C6.1 43.03,49.11 R24.1
  Top 0.406: U1.4 42.6,22.78 v42.02,22.21 C3.+ | v38.61,28.7 36.96,30.35 36.96,38.86 v36.45,39.37
  Top 0.61: v37.59,18.29 31.88,18.29 27.43,13.84 v22.73,13.84 v2.16,13.84 1.4,14.61 1.4,45.47 TDB-05.+
  Bottom 0.254: v9.53,67.44 C16.1 9.6,68.75 C5.2 v11.3,71.75 | U$1.3 6.86,19.18 3.85,16.17 C24.2 v2.16,13.84 | C1.2 TDB-05.+ | T4.E 25.97,10.86 24.51,12.32 SJ2.1 | v40.51,50.42 40.26,50.16 IC1.8
  Bottom 0.406: L2.1 40.19,20.38 v42.02,22.21 38.61,25.63 v38.61,28.7 | SJ2.1 v22.73,13.84 | IC1.8 36.96,50.16 35.81,49.02 35.81,40.01 v36.45,39.37
  Bottom 0.61: v9.53,67.44 9.14,67.44 5.08,63.37 5.08,53.47 TDB-05.+ | L2.1 38.23,18.92 v37.59,18.29
ADC2/I-AKT  (via drill 0.5)
  Top 0.254: U$2.26 17.11,67.6 17.53,67.18 v17.53,65.79 17.14,65.41 17.14,56.77 17.91,56.01 v26.67,56.01
  Bottom 0.254: IC11.IS 27.56,58.93 27.18,58.55 27.18,56.52 v26.67,56.01 | v17.53,65.79 R19.2
ADC3/I-12V  (via drill 0.5)
  Top 0.254: U$2.17 8.5,63.38 12.45,59.44 v12.45,56.9 | v18.54,54.48 31.11,54.48 32.89,52.7 v32.89,49.15
  Bottom 0.254: v12.45,56.9 16.13,56.9 v18.54,54.48 | R13.2 46.55,50.16 IC1.1 42.29,50.16 40.89,51.56 37.08,51.56 34.67,49.15 v32.89,49.15
ADC5/I-KICK  (via drill 0.5)
  Top 0.254: IC12.IS 26.16,61.21 25.78,60.83 25.78,56.9 25.4,56.52 18.16,56.52 17.97,56.71 17.65,57.02 17.65,64.52 18.41,65.28 18.41,67.44 v17.53,68.33 17.46,68.4 U$2.27
  Bottom 0.254: v17.53,68.33 R14.2
ADC6/I-MOT  (via drill 0.5)
  Top 0.254: U$2.13 4.97,69.2 v4.45,69.72
  Bottom 0.254: 6.6,74.67 4.94,74.67 4.45,74.17 v4.45,69.72 | R20.2 6.6,74.67 | 6.6,74.67 6.6,75.44 7.11,75.95 18.71,75.95 IC4.4
ADC8/12VIN  (via drill 0.5)
  Top 0.254: R2.2 v9.78,48.13 9.78,59.31 3.68,65.41 3.68,68.07 4.01,68.4 U$2.14
  Bottom 0.254: R2.2 v9.78,48.13
ADC9/EXT  (via drill 0.5)
  Top 0.254: R10.2 v12.06,48.13 10.79,49.4 10.79,59.69 7.01,63.48 U$2.16
  Bottom 0.254: v12.06,48.13 R10.2
ADC10/24VIN  (via drill 0.5)
  Top 0.254: U$2.22 12.5,63.43 v12.45,63.37
  Bottom 0.254: R11.1 R9.2 12.45,62.04 v12.45,63.37
AKTUATOR  (via drill 0.5)
  Top 0.254: v32.64,21.21 v34.92,21.21 | P6.3 35.81,60.21 35.81,44.96 36.45,44.32 41.27,44.32 42.04,43.56 42.04,32.77 v42.42,32.38
  Bottom 0.254: R_NULL_2.1 9.14,26.04 13.97,21.21 v32.64,21.21 | R17.1 v34.92,21.21 34.92,24 36.7,25.78 36.7,29.46 37.85,30.61 42.04,30.61 42.42,30.99 v42.42,32.38
  Bottom 0.813: IC11.OUT1 30.99,62.36 31.18,62.17 P6.3 31.37,59.68 31.37,59.31 29.85,57.79 IC11.OUT2
CANH
  Bottom 0.254: U$1.7 5.59,16.26 7.37,18.03 9.27,18.03 10.74,19.5 RJ_1.P$2 | RJ_1.P$2 | RJ_2.P$2 23.76,20.57 13.96,20.57 RJ_1.P$2 | R6.1 15.43,18.09 14.02,19.5 RJ_1.P$2
CANL
  Bottom 0.254: U$1.6 6.86,15.37 8.64,17.14 9.65,17.14 10.79,18.29 13.47,18.29 RJ_1.P$3 16.77,14.99 19.18,14.99 SJ1.1 22.35,16.38 22.86,15.88 25.64,15.88 RJ_2.P$3
DIV-AKKU  (via drill 0.5)
  Top 0.254: VR3.2 VR2.1 22.54,23.82 21.72,24.64 21.72,26.04 v19.94,27.81
  Bottom 0.254: R35.1 R30.2 20,27.81 v19.94,27.81
DIV-EXT  (via drill 0.5)
  Top 0.254: VR2.2 20.83,27.7 20.83,33.91 20.19,34.54 20,34.54 R46.2 R45.1 19.62,38.29 18.16,39.75 v18.16,41.78
  Bottom 0.254: v18.16,41.78 18.16,43.69 18.41,43.94 19.54,43.94 VR1.2
GND  (via drill 0.5)
  other vias: 11.3,67.44 9.53,71.75 13.08,71.75 42.04,12.19 8.51,84.45 38.99,6.6 2.16,83.06 4.57,66.17 13.21,43.05 4.57,51.44 19.68,26.29 21.72,28.19 30.61,24.77 43.81,20.32 29.72,1.78 31.11,15.75 30.61,6.22 49.78,37.34 33.02,45.72 40.51,46.1 25.4,52.96 16.32,61.59 30.73,71.5 40.89,54.74 2.41,21.34
  pour Bottom: 0,99.82 53.34,99.82 53.34,0 0,0
  pour Top: 0,99.82 53.34,99.82 53.34,0 0,0
ICLED_AKT  (via drill 0.5)
  Top 0.254: v37.85,1.52 GELB.C | U$2.30 17.07,70.8 v18.29,72.01 | v30.61,19.3 28.7,21.21 19.68,21.21 17.53,23.37 17.53,37.97 16.26,39.24 16.26,53.09 14.99,54.36 14.99,62.99 15.24,63.25 15.24,64.52 v15.75,65.02 | v32.13,17.02 32.13,4.32 32.38,4.06 36.8,4.06 GELB.C | GELB.C 38.26,2.63
  Bottom 0.254: T6.3 v37.85,1.52 | v15.75,65.02 15.75,69.47 v18.29,72.01 | v30.61,19.3 32.13,17.78 v32.13,17.02
ICLED_GRUEN  (via drill 0.5)
  Top 0.254: U$2.28 17,69.2 v18.03,70.23 | v43.81,3.05 42.45,3.05 GRÜN.C 42.42,4.06 44.58,4.06 44.96,4.45 44.96,9.53 42.93,11.56 42.93,18.29 41.15,20.07 31.88,20.07 29.21,22.73 19.94,22.73 18.54,24.13 18.54,38.48 17.27,39.75 17.27,54.61 15.49,56.39 15.49,62.74 v16.13,63.37
  Bottom 0.254: v18.03,70.23 16.64,68.83 16.64,63.88 v16.13,63.37 | T7.3 43.73,2.96 v43.81,3.05
ICLED_KICK  (via drill 0.5)
  Top 0.254: KICK.C v40.13,1.52 | v42.04,14.22 42.04,18.41 40.89,19.56 31.62,19.56 28.96,22.23 19.56,22.23 18.03,23.75 18.03,38.23 16.76,39.5 16.76,53.85 v16.38,54.23 | v13.46,54.23 13.97,54.74 13.97,63.5 14.1,63.63 U$2.24
  Bottom 0.254: v40.13,1.52 40.13,4.06 | 40.13,4.06 T2.3 | 40.13,4.06 44.58,4.06 44.96,4.45 44.96,10.41 44.58,10.79 43.94,10.79 43.69,11.05 43.69,12.57 v42.04,14.22 | v16.38,54.23 v13.46,54.23
ICLED_ROT  (via drill 0.5)
  Top 0.254: ROT.C v35.56,1.52 | v13.46,52.7 12.57,53.59 12.57,54.74 13.3,55.47 U$2.23 | v29.08,18.41 29.08,19.81 28.19,20.7 19.3,20.7 17.02,22.99 17.02,37.72 15.75,38.99 15.75,52.32 v15.37,52.7
  Bottom 0.254: v35.56,1.52 35.56,3.94 | 35.56,3.94 T5.3 | v29.08,18.41 29.08,14.61 26.8,12.32 26.8,8.89 27.05,8.64 27.05,4.45 27.43,4.06 35.43,4.06 35.56,3.94 | v13.46,52.7 v15.37,52.7
KICKER  (via drill 0.5)
  Top 0.254: v32.64,24 v36.32,24 | P6.4 35.31,56.53 35.31,44.7 36.2,43.81 41.02,43.81 41.53,43.31 41.53,31.88 41.91,31.5 v43.31,31.5
  Top 0.813: IC12.OUT2 29.85,62.35 31.37,60.83 31.37,60.47 P6.4 31.3,57.98 31.11,57.78 IC12.OUT1
  Bottom 0.254: R_NULL_1.1 15.62,22.23 30.86,22.23 v32.64,24 | R23.1 35.81,16.19 35.81,23.5 v36.32,24 37.21,24.89 37.21,29.21 38.1,30.1 42.93,30.1 43.31,30.48 v43.31,31.5
LED_BLAU  (via drill 0.5)
  Top 0.254: v10.03,15.62 10.03,35.81 9.27,36.58 SV2.9
  Bottom 0.254: T4.C 25.02,10.54 22.73,12.83 12.83,12.83 v10.03,15.62
LED_GELB
  Bottom 0.254: SV2.5 9.14,28.7 R_NULL_2.2
LED_GRUEN
  Bottom 0.254: SV2.7 9.78,30.61 10.18,30.61 R_NULL_4.2
LED_KICK
  Bottom 0.254: SV4.9 14.61,35.31 R_NULL_1.2
LED_ROT
  Bottom 0.254: SV2.3 7.62,27.69 R_NULL_3.2
MOTION  (via drill 0.5)
  Top 0.254: v36.7,22.86 33.02,22.86 v32.64,22.48
  Top 3.81: IC4.5 26.27,72.12 28.19,74.04 28.19,81.79 28.72,82.32 | IC4.1 28.72,82.32 | 28.72,82.32 32.38,85.98 33.78,85.98 | 33.78,85.98 33.86,85.9 P8.4 | P8.3 33.86,85.98 33.78,85.98
  Bottom 0.254: P8.4 37.22,80.52 50.04,80.52 50.67,79.88 50.67,30.23 50.04,29.59 38.35,29.59 37.72,28.96 37.72,23.88 v36.7,22.86 36.7,17.59 R15.1 | R_NULL_4.1 10.29,25.78 14.35,21.72 31.88,21.72 v32.64,22.48
N$1
  Bottom 0.254: R5.2 10.29,57.66 10.86,57.09 T1.1
N$2
  Bottom 0.254: RJ_2.P$4 26.47,18.29 23.5,18.29 22.23,19.56 15.8,19.56 RJ_1.P$4
  Bottom 0.406: SJ2.2 28.07,15.88 28.07,19.12 RJ_2.P$4
N$4
  Bottom 0.254: R23.2 37.21,11.96 T2.1
N$5
  Top 0.254: R29.2 KICK.A
N$6
  Bottom 0.254: U$1.8 4.32,10.98 R31.2
N$7
  Bottom 0.254: R6.2 18.23,16.2 19.56,17.53 20.19,17.53 SJ1.2
N$8
  Top 0.254: R25.2 GELB.A
N$9
  Top 0.254: R26.2 ROT.A
N$10
  Top 0.254: Q1.2 3.68,84.62 C10.2 4.57,82.13 4.57,72.14 5.91,70.8 U$2.11
N$11
  Top 0.254: Q1.1 13.34,84.62 C11.2 11.64,82.89 10.67,81.92 5.59,81.92 5.21,81.53 5.21,72.39 5.97,71.63 6.98,71.63 U$2.10
N$12  (via drill 0.5)
  Top 0.254: v18.92,48.26 18.92,52.58 19.43,53.09 OK1.1
  Bottom 0.254: R32.1 18.29,47.62 v18.92,48.26
N$13  (via drill 0.5)
  Top 0.254: U$2.21 11.7,66.06 v13.08,67.44
  Bottom 0.254: v13.08,67.44 C14.2
N$14
  Bottom 0.254: R1.2 32.22,5.27 T3.1
N$15
  Top 0.254: R4.2 LED_BLAU.A
N$16  (via drill 0.5)
  Top 0.254: v33.27,1.52 LED_BLAU.C
  Bottom 0.254: v33.27,1.52 T3.3 22.56,2.96 21.97,3.56 R7.1
N$17
  Bottom 0.254: R7.2 23.92,7.17 T4.B
N$18  (via drill 0.5)
  Top 0.254: v19.3,46.74 19.81,47.24 19.81,48.64 19.43,49.02 19.43,51.56 v19.94,52.07 | v26.8,52.07 27.05,51.82 OK1.7
  Bottom 0.254: VR1.1 18.73,46.17 v19.3,46.74 | v19.94,52.07 v26.8,52.07
N$19
  Top 0.254: OK1.2 OK1.3
N$20
  Bottom 0.406: T1.3 9.91,56.26 TDB-05.-
N$21
  Top 0.254: R27.2 GRÜN.A
N$22  (via drill 0.5)
  Top 0.406: C2.+ 46.86,15.61 U1.7 v46.86,20.32
  Bottom 0.61: F1.2 45.47,27.18 46.86,25.78 v46.86,20.32
N$24
  Top 0.254: R28.2 12V.A
N$25  (via drill 0.5)
  Top 0.254: R22.1 47.56,48.71 v49.4,46.86
  Bottom 0.254: IC1.2 46.55,48.9 R13.1 R21.2 49.4,48.33 v49.4,46.86
N$26
  Top 0.254: R24.2 47.56,46.8 45.85,48.51 45.85,48.83 R22.2 45.66,52.17 D4.3
N$27  (via drill 0.5)
  Top 0.254: U1.8 48.42,17.86 C4.2
  Top 0.406: U1.8 48.13,16.26 v48.51,15.88
  Bottom 0.406: D2.K 50.06,14.33 v48.51,15.88 50.49,17.85 L2.2
N$28
  Bottom 1.422: Q2.S Q3.S
N$29
  Top 0.254: U1.1 48.42,22.78 C4.1
N$30
  Top 0.254: Q4.G Q5.G 23.37,35.56 24.64,36.83 24.64,46.99 26.04,48.39 26.04,50.04 26.54,50.55 OK1.6
  Bottom 0.254: Q4.G 23.37,29.21 26.04,26.54 26.04,26.48 R42.2
N$31
  Bottom 1.422: Q4.S Q5.S
N$32  (via drill 0.5)
  Top 0.254: OK1.5 29.72,49.28 30.35,48.64 v30.35,48.01 | v30.1,26.42 27.29,26.42 VR3.1
  Bottom 0.254: v30.35,48.01 30.35,26.67 v30.1,26.42
N$35
  Bottom 0.254: D3.K D1.K 15.13,47.32 R32.2
N$36  (via drill 0.5)
  Top 0.254: IC12.IN 27.82,58.93 27.56,58.67 27.56,56.64 v28.19,56.01
  Bottom 0.254: v28.19,56.01 28.22,56.01 VR8.1
N$37
  Bottom 0.254: IC4.2 19.99,86.02 VR9.1
N$40
  Bottom 0.254: IC11.IN 26.16,61.21 25.78,60.83 25.78,55.5 26.16,55.12 28.07,55.12 28.45,54.74 28.45,53.85 28.83,53.47 33.51,53.47 VR7.1
N$42
  Bottom 0.254: R37.1 44.77,63.31 43.43,61.98 43.43,58.1 R36.2 45.79,56.7 46.1,56.39 46.1,53.98 45.85,53.72 40.39,53.72 39.67,54.44 VR7.2
N$44
  Bottom 0.254: VR8.2 31.56,54.67 32.64,55.75 41.59,55.75 R38.2 R39.1
N$45
  Bottom 0.254: VR9.2 19.12,87.19 20.07,88.14 22.35,88.14 22.99,88.77 23.18,88.77 R41.1 R40.2
N$49
  Top 0.254: Q3.G Q2.G | 23.37,46.1 Q2.G | OK1.8 26.67,53.09 25.4,51.82 25.4,48.64 24.77,48.01 23.88,48.01 23.37,47.5 Q2.G
  Bottom 0.254: Q2.G 23.37,48.19 R34.2
N$102
  Bottom 0.254: R16.2 32.64,11.96 T5.1
N$104
  Bottom 0.254: R17.2 34.92,11.68 35.31,11.3 37.08,11.3 37.47,10.92 37.47,5.73 T6.1
N$106
  Bottom 0.254: R15.2 39.5,11.68 39.88,11.3 41.78,11.3 42.16,10.92 42.16,5.86 T7.1
N$108
  Top 0.254: R18.1 5V.A
RST  (via drill 0.5)
  Top 0.254: v16.38,77.47 17.14,76.71 17.14,72.01 16.73,71.6 U$2.31
  Bottom 0.254: ISP.5 17.14,95 17.14,91.82 16.38,91.06 v16.38,77.47
RXCAN  (via drill 0.5)
  Top 0.254: U$2.7 9.3,78.96 v9.27,78.99
  Bottom 0.254: v9.27,78.99 8,80.26 2.16,80.26 1.65,79.76 1.65,24.13 3.94,21.84 7.75,21.84 8.13,21.46 U$1.4
SPEAKER  (via drill 0.5)
  Top 0.254: U$2.18 9.3,64.36 v10.29,63.37
  Bottom 0.254: 10.29,61.98 R5.1 v10.29,63.37
SW_1/SCK_A  (via drill 0.5)
  Top 0.254: U$2.12 5.82,70 3.81,72.01 v3.81,83.06
  Bottom 0.254: ISP.7 14.35,97.79 13.08,97.79 11.94,96.65 11.94,91.19 v3.81,83.06
SW_2/MOSI_A
  Top 0.254: U$2.2 13.3,79.34 24.89,90.93 24.89,94.87 ISP.1
SW_3/MISO_A  (via drill 0.5)
  Top 0.254: U$2.1 14.1,77.86 v14.61,78.36
  Bottom 0.254: ISP.9 14.61,95 v14.61,78.36
SW_12V  (via drill 0.5)
  Top 0.254: U$2.15 4.86,67.6 v4.83,67.56 | OK1.4 20.57,49.28 v20.32,49.53
  Bottom 0.254: SV2.4 5.08,30.23 5.08,37.21 | 5.08,37.21 3.68,38.61 3.68,66.42 v4.83,67.56 | 5.08,37.21 6.1,38.23 6.1,47.62 7.11,48.64 8.26,48.64 9.14,49.53 v20.32,49.53
SW_AKT  (via drill 0.5)
  Top 0.254: U$2.8 8.5,77.98 v7.87,78.61 | 5.08,32.77 SV2.6 | v5.08,38.48 5.08,32.77 | 5.08,32.77 8.89,32.77 v9.14,33.02
  Bottom 0.254: SV2.6 2.16,33.15 2.16,78.61 2.79,79.25 7.11,79.25 v7.87,78.61 | VR7.3 33.74,50.55 9.4,50.55 8,49.15 6.86,49.15 5.08,47.37 v5.08,38.48 | SJ3.1 10.41,33.27 10.16,33.02 v9.14,33.02
SW_BLAU  (via drill 0.5)
  Top 0.254: U$2.3 12.5,77.16 v12.45,77.22
  Bottom 0.254: SV2.10 3.17,37.21 3.17,77.09 3.56,77.47 12.19,77.47 v12.45,77.22
SW_KICK  (via drill 0.5)
  Top 0.254: U$2.25 15.23,66.8 14.73,66.29 14.73,63.5 14.48,63.25 v14.48,51.82 14.48,37.72 SV4.10
  Bottom 0.254: SJ3.2 SV4.10 | v14.48,51.82 18.41,51.82 19.18,51.05 29.29,51.05 VR8.3
SW_MOT  (via drill 0.5)
  Top 0.254: v17.78,88.77 17.78,86.23 12.95,81.41 8.13,81.41 6.1,79.38 v6.1,78.36 7.01,77.44 U$2.9
  Bottom 0.254: SV2.8 2.67,35.18 2.67,78.11 2.92,78.36 v6.1,78.36 | VR9.3 18.25,89.24 v17.78,88.77
TXCAN  (via drill 0.5)
  Top 0.254: U$2.6 10.1,80.07 v10.03,80.14
  Bottom 0.254: U$1.1 4.32,20.7 1.14,23.88 1.14,80.14 1.91,80.9 9.27,80.9 v10.03,80.14

### Text on the board
tNames: CNC PowerSwitch / 2016 v0.92 / info@das-lab.net
Document: Speaker